# Altium schematic sheet ControlBoard.SchDoc
size A4
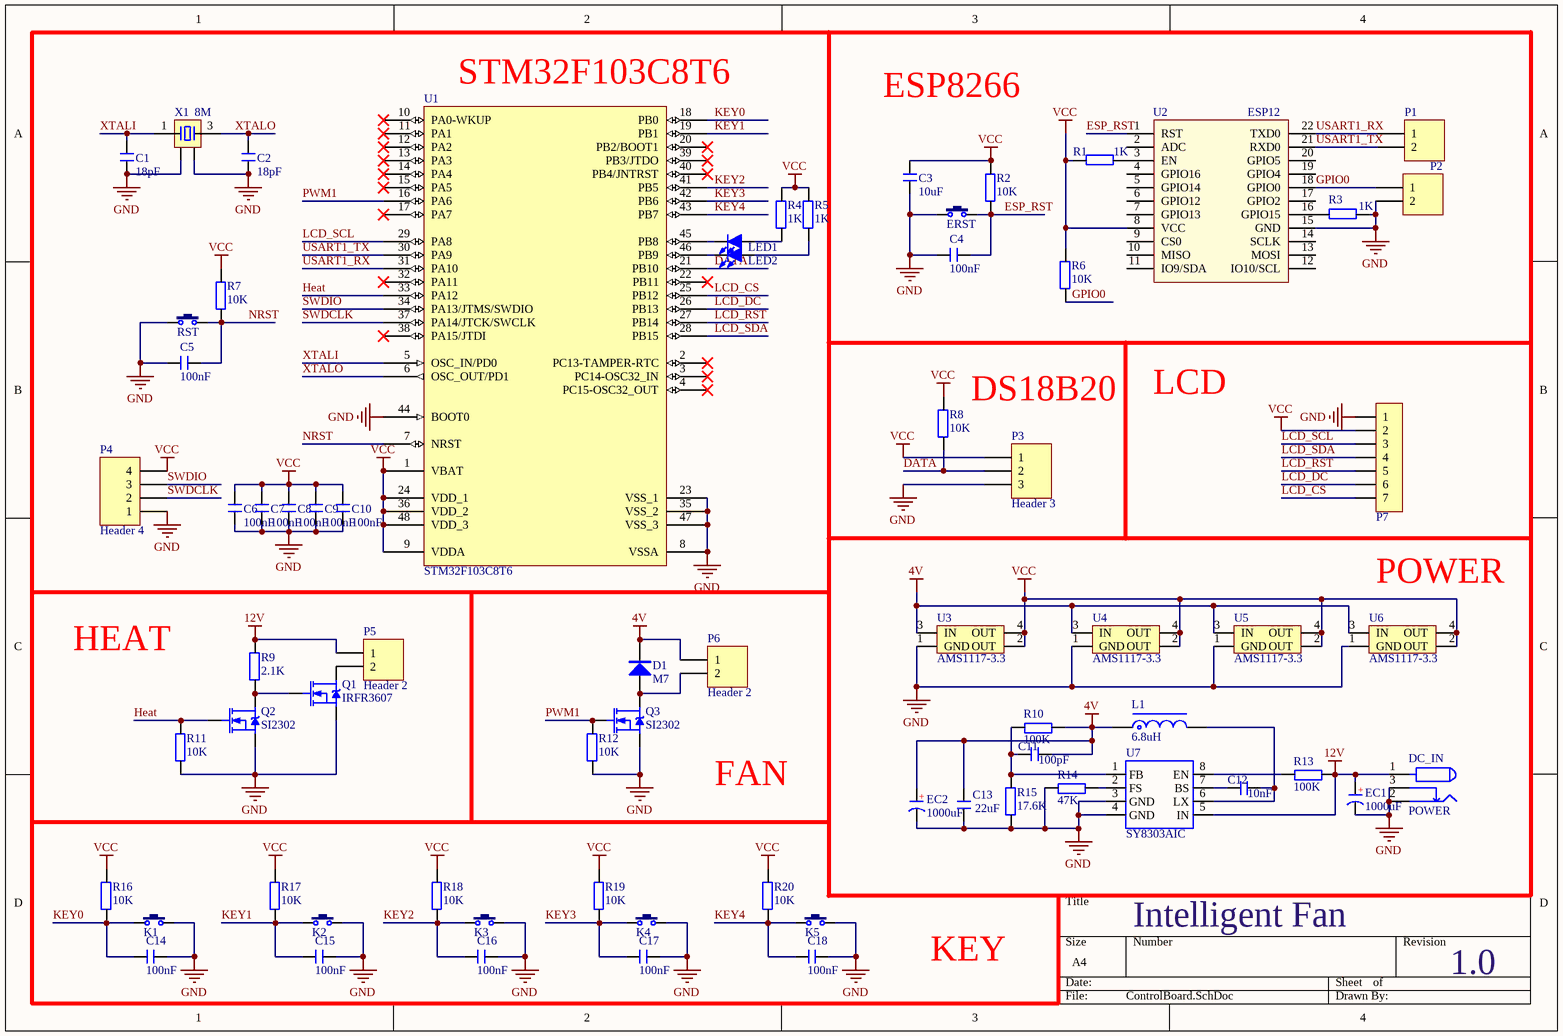
[diagram p0: ControlBoard.SchDoc]

## Parts
C1  value 18pF  [C 0603]  (hidden comment: C)
C2  value 18pF  [C 0603]  (hidden comment: C)
C3  value 10uF  [C 1206]  (hidden comment: C)
C4  value 100nF  [C 0603]  (hidden comment: C)
C5  value 100nF  [C 0603]  (hidden comment: C)
C6  value 100nF  [C 0603]  (hidden comment: C)
C7  value 100nF  [C 0603]  (hidden comment: C)
C8  value 100nF  [C 0603]  (hidden comment: C)
C9  value 100nF  [C 0603]  (hidden comment: C)
C10  value 100nF  [C 0603]  (hidden comment: C)
C11  value 100pF  [C 0603]  (hidden comment: C)
C12  value 10nF  [C 0603]  (hidden comment: C)
C13  value 22uF  [C 0603]  (hidden comment: C)
C14  value 100nF  [C 0603]  (hidden comment: C)
C15  value 100nF  [C 0603]  (hidden comment: C)
C16  value 100nF  [C 0603]  (hidden comment: C)
C17  value 100nF  [C 0603]  (hidden comment: C)
C18  value 100nF  [C 0603]  (hidden comment: C)
D1  M7  [SMA]
DC_IN  POWER  [DC10B]
EC1  value 1000uF  [CM F(10*10.2)]  (hidden comment: C-CM)
EC2  value 1000uF  [CM F(10*10.2)]  (hidden comment: C-CM)
ERST  3x6x5  [TSW SMD-3*6*4.3]  (value not drawn)
K1  3x6x5  [TSW SMD-3*6*4.3]  (value not drawn)
K2  3x6x5  [TSW SMD-3*6*4.3]  (value not drawn)
K3  3x6x5  [TSW SMD-3*6*4.3]  (value not drawn)
K4  3x6x5  [TSW SMD-3*6*4.3]  (value not drawn)
K5  3x6x5  [TSW SMD-3*6*4.3]  (value not drawn)
L1  value 6.8uH  [CDRH74]  (hidden comment: 2A)
LED1  红色  [LED 0603B]  (value not drawn)
LED2  红色  [LED 0603B]  (value not drawn)
P1  Header 2  [HDR1X2]  (value not drawn)
P2  Header 2  [HDR1X2]  (value not drawn)
P3  Header 3  [HDR1X3]
P4  Header 4  [HDR1X4]
P5  Header 2  [HDR1X2]
P6  Header 2  [HDR1X2]
P7  HDR-1X7  [HDR1X7]  (value not drawn)
Q1  IRFR3607  [TO252]
Q2  SI2302  [SOT23-3N]
Q3  SI2302  [SOT23-3N]
R1  1K  [R 0603]
R2  10K  [R 0603]
R3  1K  [R 0603]
R4  1K  [R 0603]
R5  1K  [R 0603]
R6  10K  [R 0603]
R7  10K  [R 0603]
R8  10K  [R 0603]
R9  2.1K  [R 0603]
R10  100K  [R 0603]
R11  10K  [R 0603]
R12  10K  [R 0603]
R13  100K  [R 0603]
R14  47K  [R 0603]
R15  17.6K  [R 0603]
R16  10K  [R 0603]
R17  10K  [R 0603]
R18  10K  [R 0603]
R19  10K  [R 0603]
R20  10K  [R 0603]
RST  3x6x5  [TSW SMD-3*6*4.3]  (value not drawn)
U1  STM32F103C8T6  [LQFP48 7X7_N]
U2  ESP12  [ESP-12E&F Module]
U3  AMS1117-3.3  [AMS1117]
U4  AMS1117-3.3  [AMS1117]
U5  AMS1117-3.3  [AMS1117]
U6  AMS1117-3.3  [AMS1117]
U7  SY8303AIC  [SOT23_8]
X1  8M  [XTAL-3225]

## Nets
4V: C11.2 C13.1 D1.2(K) EC2.1(A) L1.1 P6.1 R10.2 U3.3(IN) U4.3(IN) U5.3(IN) U6.3(IN)
12V: DC_IN.1 EC1.1(A) P5.1 R9.1 R13.2 U7.5(IN)
GND: C1.1 C2.1 C3.1 C4.1 C5.1 C6.1 C7.1 C8.1 C9.1 C10.1 C13.2 C14.2 C15.2 C16.2 C17.2 C18.2 DC_IN.2 DC_IN.3 EC1.2(K) EC2.2(K) ERST.1 K1.2 K2.2 K3.2 K4.2 K5.2 P2.2 P3.3 P4.1 P7.1 Q1.3(S) Q2.2(S) Q3.2(S) R3.1 R11.2 R12.2 R14.1 R15.2 RST.1 U1.8(VSSA) U1.23(VSS_1) U1.35(VSS_2) U1.44(BOOT0) U1.47(VSS_3) U2.15(GND) U3.1(GND) U4.1(GND) U5.1(GND) U6.1(GND) U7.3(GND) U7.4(GND) X1.2 X1.4
VCC: C3.2 C6.2 C7.2 C8.2 C9.2 C10.2 P3.1 P4.4 P7.2 R1.2 R2.1 R4.1 R5.1 R6.1 R7.1 R8.1 R16.1 R17.1 R18.1 R19.1 R20.1 U1.1(VBAT) U1.9(VDDA) U1.24(VDD_1) U1.36(VDD_2) U1.48(VDD_3) U2.8(VCC) U3.2(OUT) U3.4(OUT) U4.2(OUT) U4.4(OUT) U5.2(OUT) U5.4(OUT) U6.2(OUT) U6.4(OUT)
DATA: P3.2 R8.2 U1.21(PB10)
ESP_RST: C4.2 ERST.2 R2.2 U2.1(RST)
GPIO0: P2.1 R6.2 U2.18(GPIO0)
Heat: Q2.1(G) R11.1 U1.33(PA12)
KEY0: C14.1 K1.1 R16.2 U1.18(PB0)
KEY1: C15.1 K2.1 R17.2 U1.19(PB1)
KEY2: C16.1 K3.1 R18.2 U1.41(PB5)
KEY3: C17.1 K4.1 R19.2 U1.42(PB6)
KEY4: C18.1 K5.1 R20.2 U1.43(PB7)
LCD_CS: P7.7 U1.25(PB12)
LCD_DC: P7.6 U1.26(PB13)
LCD_RST: P7.5 U1.27(PB14)
LCD_SCL: P7.3 U1.29(PA8)
LCD_SDA: P7.4 U1.28(PB15)
NRST: C5.2 R7.2 RST.2 U1.7(NRST)
PWM1: Q3.1(G) R12.1 U1.16(PA6)
SWDCLK: P4.2 U1.37(PA14/JTCK/SWCLK)
SWDIO: P4.3 U1.34(PA13/JTMS/SWDIO)
USART1_RX: P1.1 U1.31(PA10) U2.22(TXD0)
USART1_TX: P1.2 U1.30(PA9) U2.21(RXD0)
XTALI: C1.2 U1.5(OSC_IN/PD0) X1.1
XTALO: C2.2 U1.6(OSC_OUT/PD1) X1.3
NetC11_1: C11.1 R10.1 R15.1 U7.1(FB)
NetC12_1: C12.1 U7.7(BS)
NetC12_2: C12.2 L1.2 U7.6(LX)
NetD1_1: D1.1(A) P6.2 Q3.3(D)
NetLED1_1: LED1.1(A) R4.2
NetLED1_2: LED1.2(K) U1.45(PB8)
NetLED2_1: LED2.1(A) R5.2
NetLED2_2: LED2.2(K) U1.46(PB9)
NetP5_2: P5.2 Q1.2(D)
NetQ1_1: Q1.1(G) Q2.3(D) R9.2
NetR1_1: R1.1 U2.3(EN)
NetR3_2: R3.2 U2.16(GPIO15)
NetR13_1: R13.1 U7.8(EN)
NetR14_2: R14.2 U7.2(FS)

Not connected (* = marked no-connect by the designer): U1 2(PC13-TAMPER-RTC)* 3(PC14-OSC32_IN)* 4(PC15-OSC32_OUT)* 10(PA0-WKUP)* 11(PA1)* 12(PA2)* 13(PA3)* 14(PA4)* 15(PA5)* 17(PA7)* 20(PB2/BOOT1)* 22(PB11)* 32(PA11)* 38(PA15/JTDI)* 39(PB3/JTDO)* 40(PB4/JNTRST)*; U2 2(ADC) 4(GPIO16) 5(GPIO14) 6(GPIO12) 7(GPIO13) 9(CS0) 10(MISO) 11(IO9/SDA) 12(IO10/SCL) 13(MOSI) 14(SCLK) 17(GPIO2) 19(GPIO4) 20(GPIO5)

## Notes on the sheet
- (near U1) STM32F103C8T6
- ESP8266
- (near R8) DS18B20
- LCD
- HEAT
- POWER
- FAN
- KEY
- Intelligent Fan
- 1.0
- (in symbol C-CM) +

## Library data of the parts
C1-C18 = C: 无极性贴片电容
D1 = M7: 整流二极管; 版权归属: 源创客; BOM名称: 整流二极管; 学习资源: www.ooocke.com
DC_IN = POW
EC1 EC2 = C-CM: 贴片电解电容
ERST K1-K5 RST = TSW 3x6: 3x6轻触开关; 版权归属: 源创客; BOM名称: 3x6轻触开关; 学习资源: www.ooocke.com
L1 = L-CDRH: 功率屏蔽电感
LED1 LED2 = LED-SMD: 贴片LED; 版权归属: 源创客; BOM名称: 贴片LED; 学习资源: www.ooocke.com
P1 P2 P5 P6 = Header 2: Header, 2-Pin; LatestRevisionDate: 17-Jul-2002; LatestRevisionNote: Re-released for DXP Platform.; Publisher: Altium Limited
P3 = Header 3: Header, 3-Pin; LatestRevisionDate: 17-Jul-2002; LatestRevisionNote: Re-released for DXP Platform.; Publisher: Altium Limited
P4 = Header 4: Header, 4-Pin; LatestRevisionDate: 17-Jul-2002; LatestRevisionNote: Re-released for DXP Platform.; Publisher: Altium Limited
P7 = Header 7: 7P接插件; 版权归属: 源创客; BOM名称: 7P接插件; 学习资源: www.ooocke.com
Q1 = IRFR3607: Nmos
Q2 Q3 = SI2302: N沟道场效应管
R1-R20 = R
U1 = STM32F103C8: Flash:64/RAM:20/IO:36; BOM名称: 32位STM单片机; 版权归属: 源创客; 学习资源: www.ooocke.com
U2 = ESP-12E&F Module
U3-U6 = AMS1117
U7 = SY8303AIC: Buck升压芯片
X1 = XTAL-4: 4脚晶振; 版权归属: 源创客; BOM名称: 4脚晶振; 学习资源: www.ooocke.com